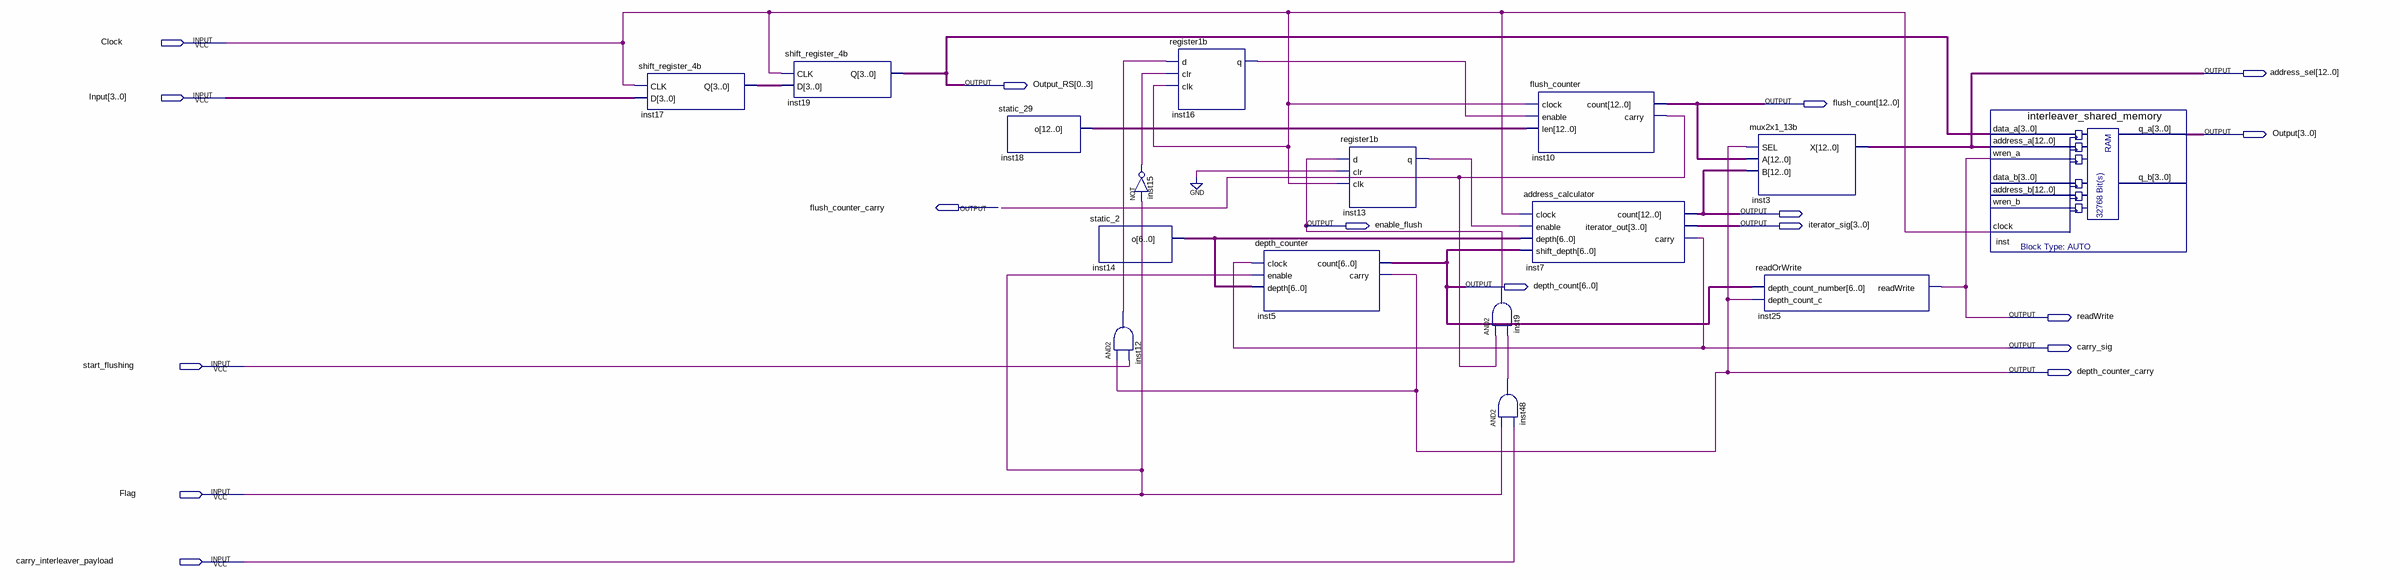
[diagram p0: schematic sheet]
// Quartus schematic interleaver_rev3.bdf as structural Verilog: 16 symbols, 17 pins
module interleaver_rev3 (
  input  Clock,
  input  [3:0] Input,
  input  start_flushing,
  input  Flag,
  input  carry_interleaver_payload,
  output [12:0] address_sel,
  output [0:3] Output_RS,
  output [12:0] flush_count,
  output [3:0] Output,
  output flush_counter_carry,
  output enable_flush,
  output [3:0] iterator_sig,
  output [6:0] depth_count,
  output readWrite,
  output carry_sig,
  output depth_counter_carry
);

  wire inst12_out, inst13_q, inst15_out, inst16_q, inst48_out;
  wire [3:0] inst17_q;
  wire [6:0] inst14_o;
  wire [12:0] inst7_count, inst18_o;

  shift_register_4b inst17 (.CLK(Clock), .D(Input), .Q(inst17_q));
  shift_register_4b inst19 (.CLK(Clock), .D(inst17_q), .Q(Output_RS));
  static_29 inst18 (.o(inst18_o));
  static_2 inst14 (.o(inst14_o));
  not inst15 (inst15_out, Flag);
  and inst12 (inst12_out, depth_counter_carry, start_flushing);
  register1b inst16 (.d(inst12_out), .clr(inst15_out), .clk(Clock), .q(inst16_q));
  depth_counter inst5 (
    .clock(carry_sig), .enable(Flag), .depth(inst14_o), .count(depth_count), .carry(depth_counter_carry));
  register1b inst13 (.d(enable_flush), .clr(1'b0), .clk(Clock), .q(inst13_q));
  and inst9 (enable_flush, flush_counter_carry, inst48_out);
  and inst48 (inst48_out, Flag, carry_interleaver_payload);
  flush_counter inst10 (
    .clock(Clock), .enable(inst16_q), .len(inst18_o), .count(flush_count), .carry(flush_counter_carry));
  address_calculator inst7 (
    .clock(Clock), .enable(inst13_q), .depth(inst14_o), .shift_depth(depth_count), .count(inst7_count),
    .iterator_out(iterator_sig), .carry(carry_sig));
  mux2x1_13b inst3 (.SEL(depth_counter_carry), .A(flush_count), .B(inst7_count), .X(address_sel));
  readOrWrite inst25 (.depth_count_number(depth_count), .depth_count_c(depth_counter_carry), .readWrite(readWrite));
  interleaver_shared_memory inst (
    .data_a(Output_RS), .address_a(address_sel), .wren_a(readWrite), .clock(Clock), .q_a(Output));  // open: data_b, address_b, wren_b, q_b
endmodule
